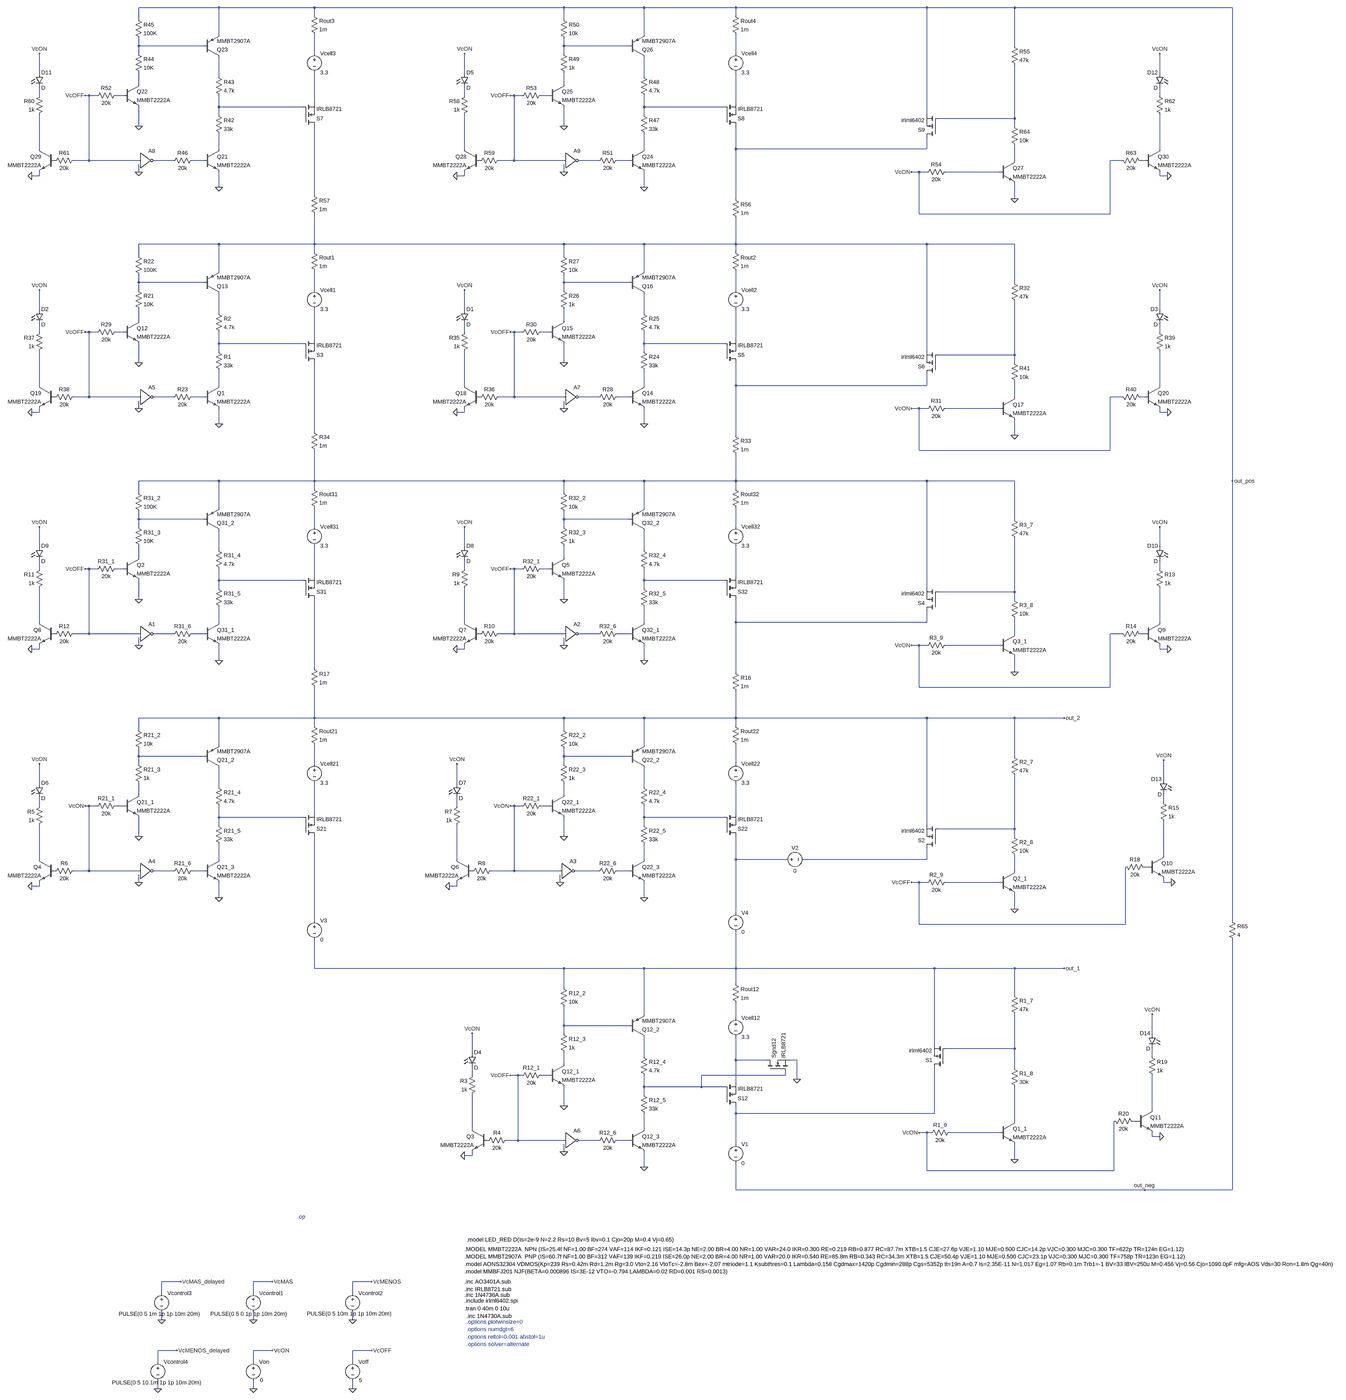
[diagram p0: schematic 5_bancos.asc, whole sheet]
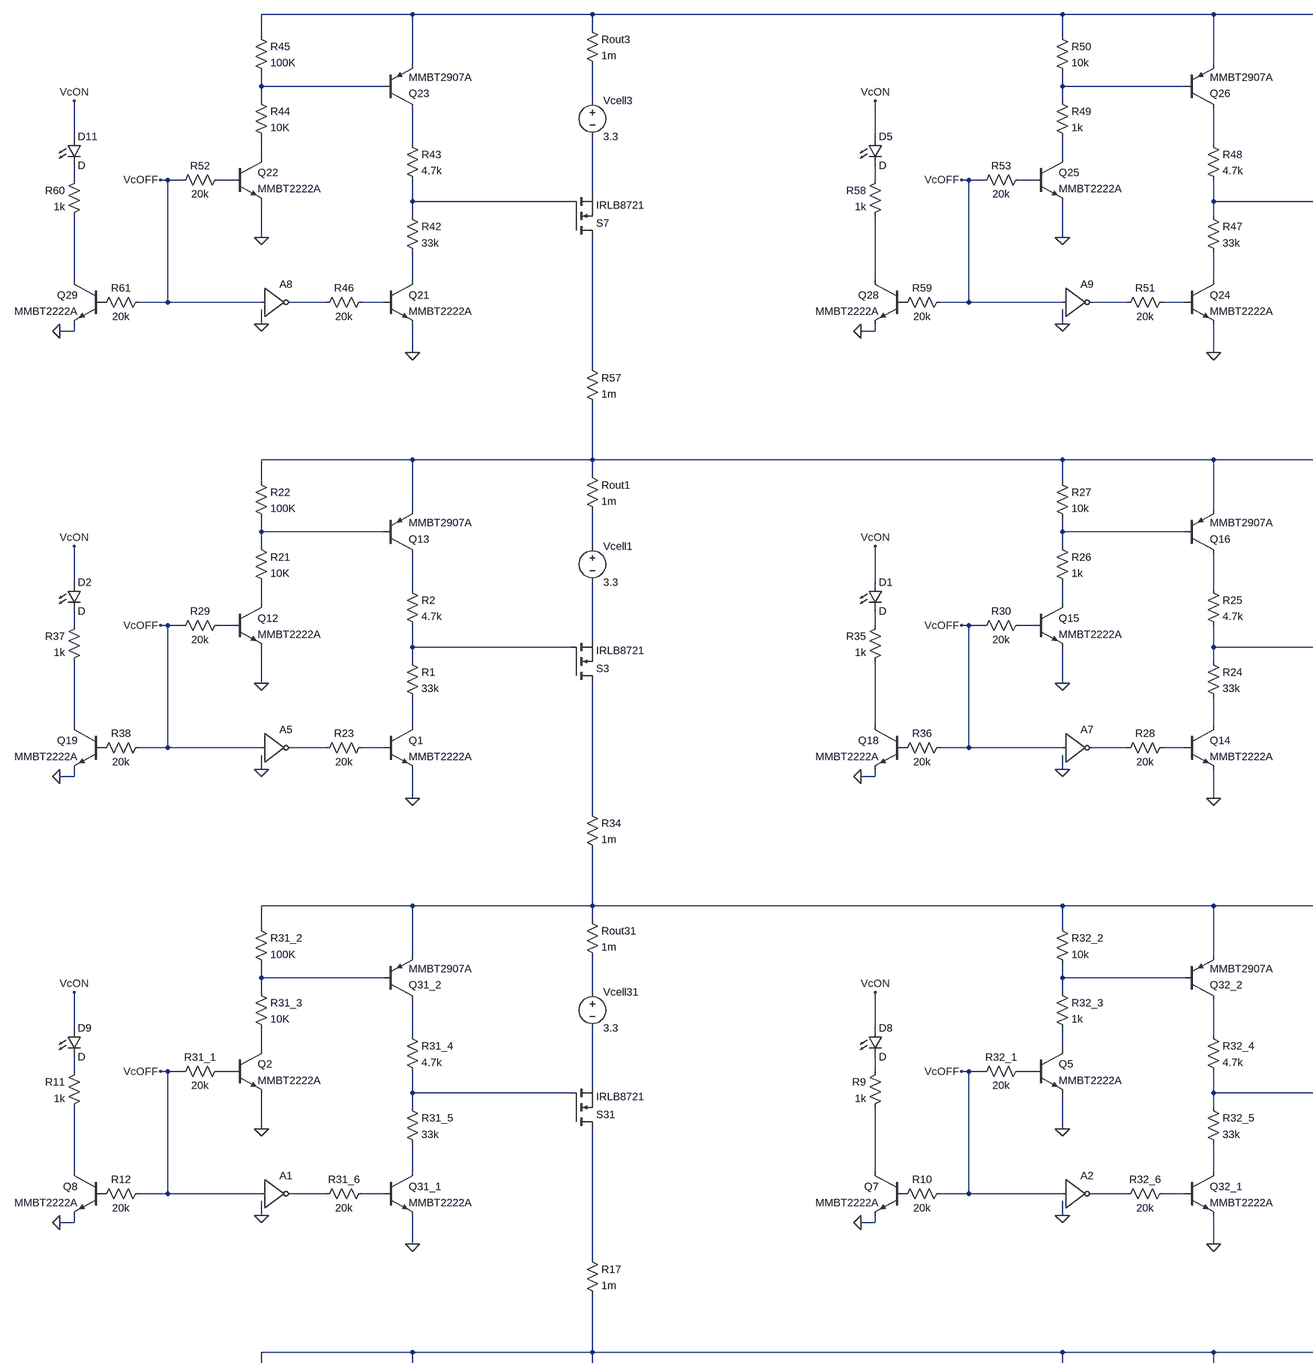
[diagram p1: schematic 5_bancos.asc, part, row 1 of 2, column 1 of 2]
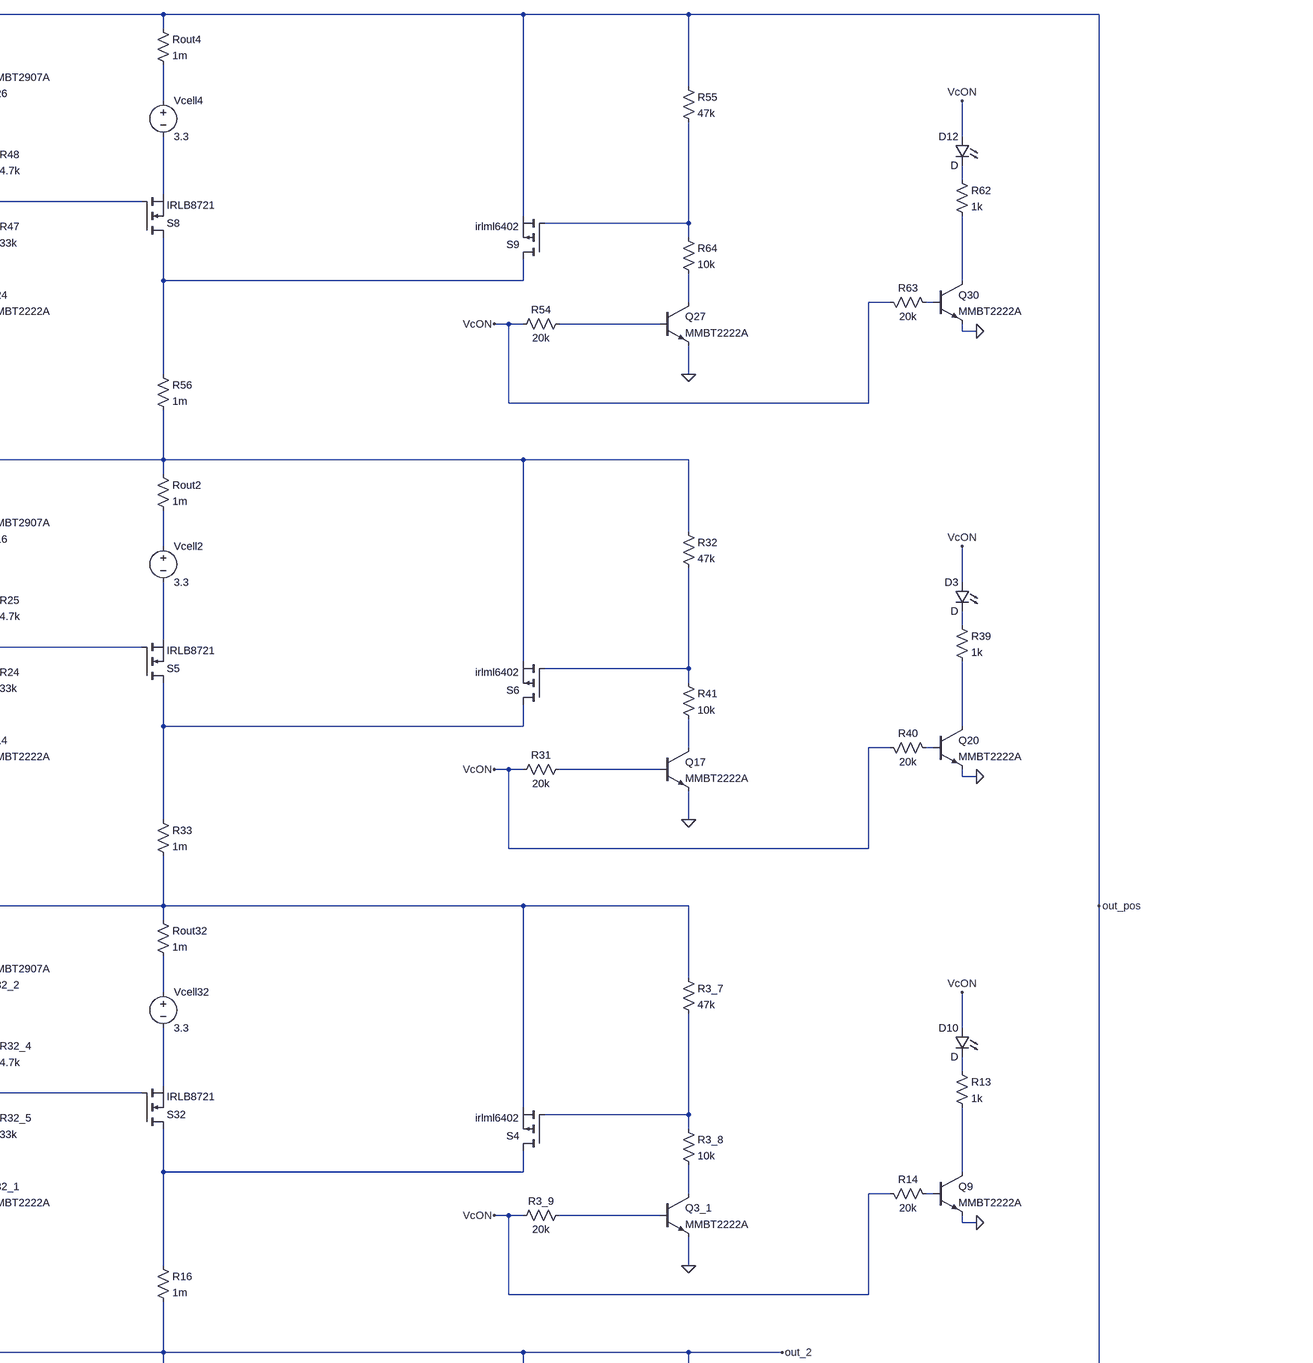
[diagram p2: schematic 5_bancos.asc, part, row 1 of 2, column 2 of 2]
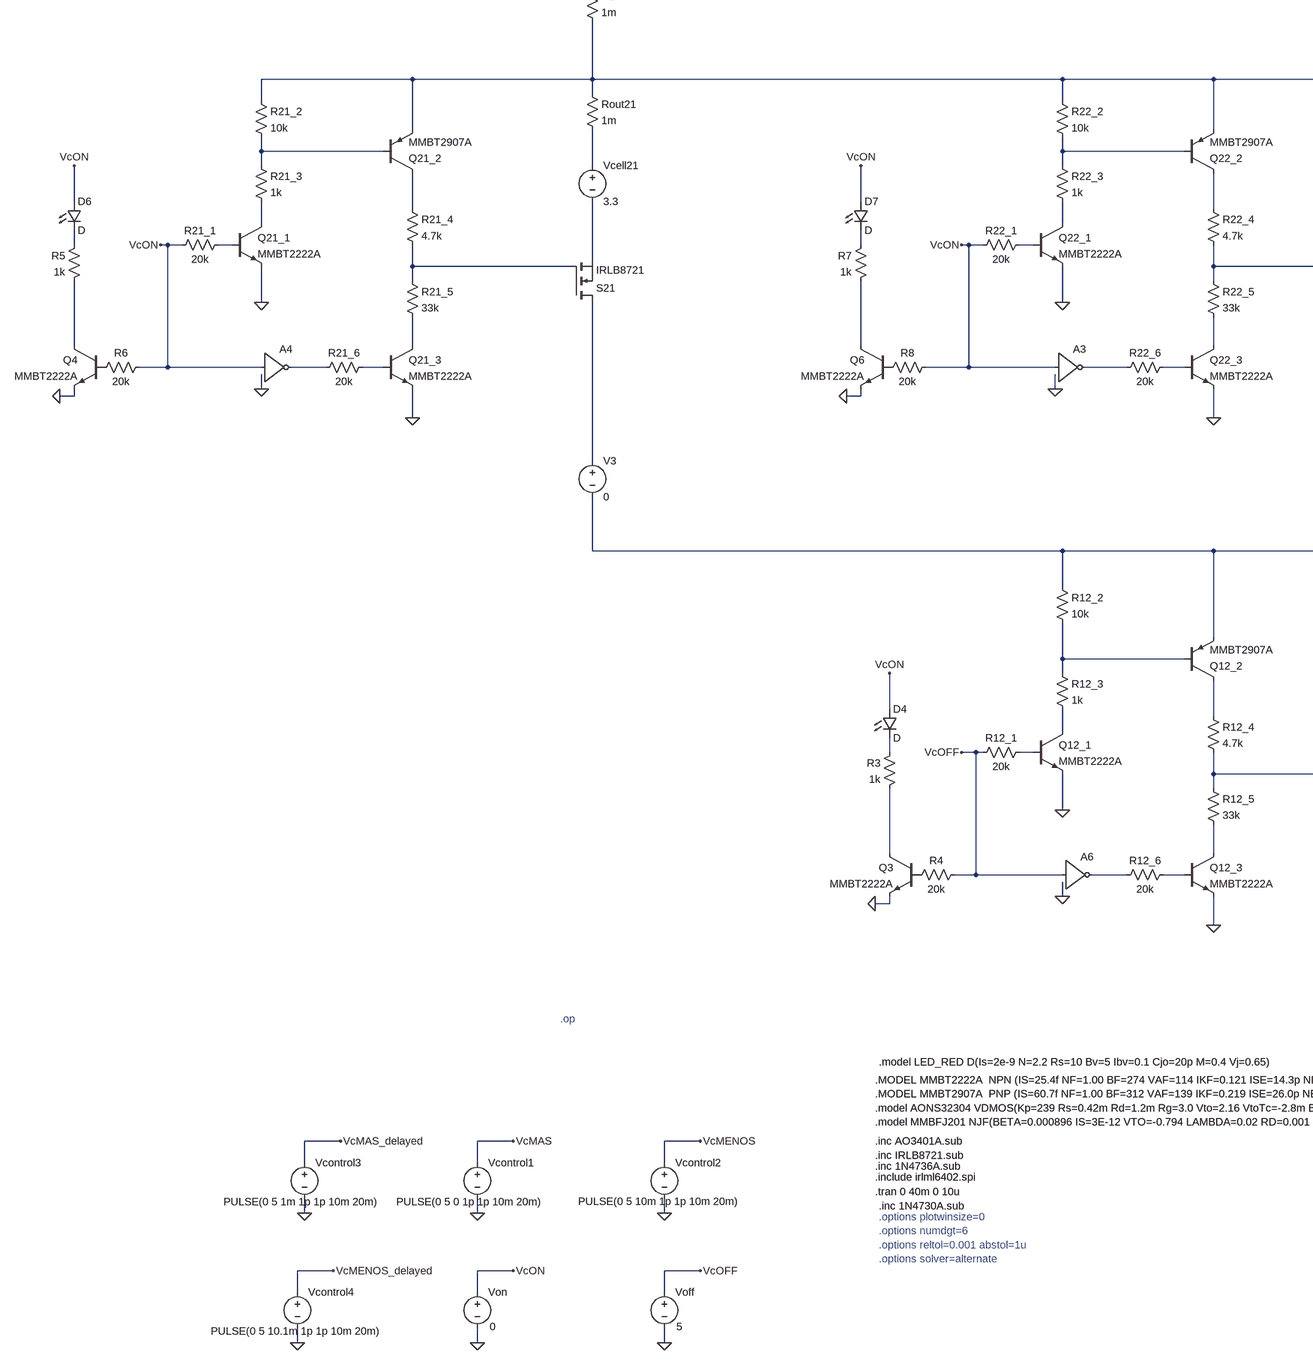
[diagram p3: schematic 5_bancos.asc, part, row 2 of 2, column 1 of 2]
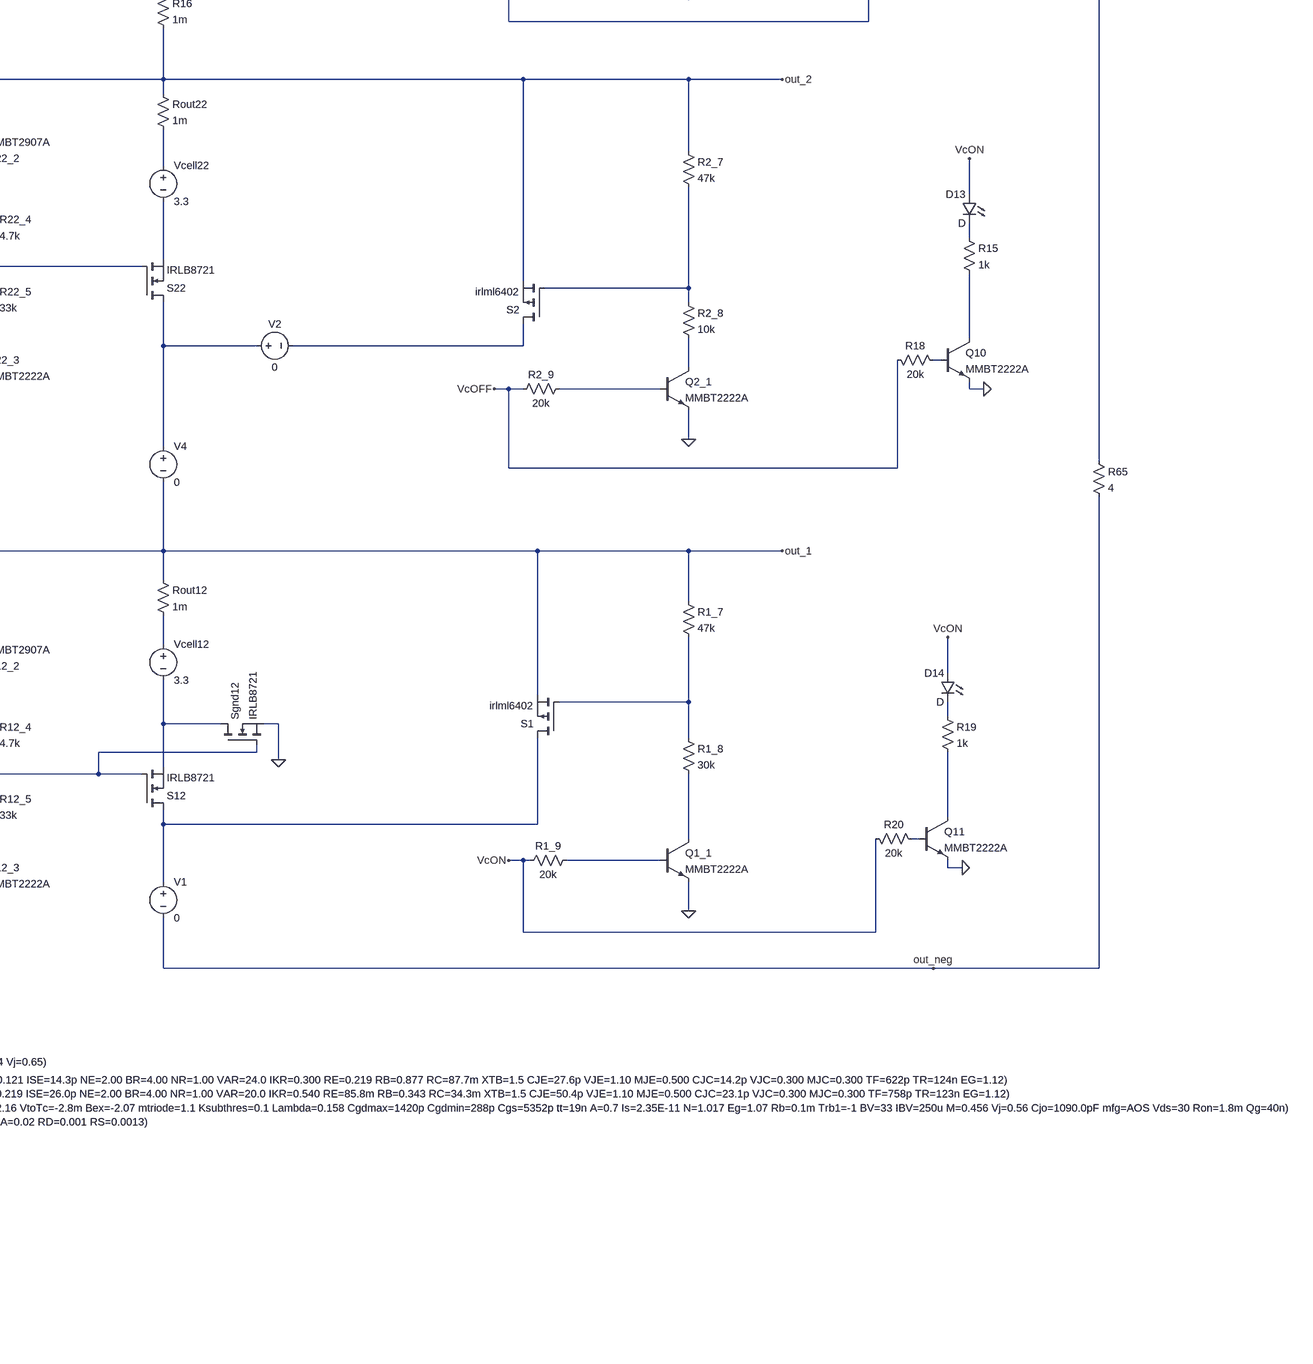
[diagram p4: schematic 5_bancos.asc, part, row 2 of 2, column 2 of 2]
5_bancos.asc, the LTspice schematic file:
Version 4.1
SHEET 1 7672 2128
WIRE -1296 -4512 -1632 -4512
WIRE -896 -4512 -1296 -4512
WIRE 192 -4512 -896 -4512
WIRE 528 -4512 192 -4512
WIRE 912 -4512 528 -4512
WIRE 1712 -4512 912 -4512
WIRE 2080 -4512 1712 -4512
WIRE 2992 -4512 2080 -4512
WIRE -896 -4480 -896 -4512
WIRE 912 -4480 912 -4512
WIRE -1632 -4464 -1632 -4512
WIRE 192 -4464 192 -4512
WIRE -1296 -4400 -1296 -4512
WIRE 528 -4400 528 -4512
WIRE -1632 -4352 -1632 -4384
WIRE -1360 -4352 -1632 -4352
WIRE 192 -4352 192 -4384
WIRE 464 -4352 192 -4352
WIRE 2080 -4352 2080 -4512
WIRE -1632 -4320 -1632 -4352
WIRE -896 -4320 -896 -4400
WIRE 192 -4320 192 -4352
WIRE 912 -4320 912 -4400
WIRE -2048 -4240 -2048 -4320
WIRE -224 -4240 -224 -4320
WIRE 2688 -4240 2688 -4320
WIRE -1296 -4224 -1296 -4304
WIRE 528 -4224 528 -4304
WIRE -1632 -4192 -1632 -4240
WIRE 192 -4192 192 -4240
WIRE -2048 -4144 -2048 -4176
WIRE -1840 -4144 -1856 -4144
WIRE -1808 -4144 -1840 -4144
WIRE -1696 -4144 -1728 -4144
WIRE -224 -4144 -224 -4176
WIRE -16 -4144 -32 -4144
WIRE 16 -4144 -16 -4144
WIRE 128 -4144 96 -4144
WIRE 2688 -4144 2688 -4176
WIRE -896 -4112 -896 -4240
WIRE 912 -4112 912 -4240
WIRE -1296 -4096 -1296 -4144
WIRE -944 -4096 -1296 -4096
WIRE 528 -4096 528 -4144
WIRE 864 -4096 528 -4096
WIRE -1296 -4064 -1296 -4096
WIRE 528 -4064 528 -4096
WIRE 1712 -4064 1712 -4512
WIRE 2080 -4048 2080 -4272
WIRE 2080 -4048 1760 -4048
WIRE -1632 -4016 -1632 -4096
WIRE 192 -4016 192 -4096
WIRE 2080 -4016 2080 -4048
WIRE -2048 -3920 -2048 -4064
WIRE -1296 -3920 -1296 -3984
WIRE -224 -3920 -224 -4064
WIRE 528 -3920 528 -3984
WIRE 912 -3920 912 -4016
WIRE 1712 -3920 1712 -3968
WIRE 1712 -3920 912 -3920
WIRE 2688 -3920 2688 -4064
WIRE -1840 -3872 -1840 -4144
WIRE -1840 -3872 -1904 -3872
WIRE -1632 -3872 -1840 -3872
WIRE -1488 -3872 -1568 -3872
WIRE -1360 -3872 -1408 -3872
WIRE -16 -3872 -16 -4144
WIRE -16 -3872 -80 -3872
WIRE 192 -3872 -16 -3872
WIRE 336 -3872 256 -3872
WIRE 464 -3872 416 -3872
WIRE 2080 -3872 2080 -3936
WIRE 2528 -3872 2480 -3872
WIRE 2624 -3872 2608 -3872
WIRE -1632 -3824 -1632 -3856
WIRE 192 -3824 192 -3856
WIRE 1680 -3824 1648 -3824
WIRE 1712 -3824 1680 -3824
WIRE 2016 -3824 1792 -3824
WIRE -2048 -3808 -2048 -3824
WIRE -2048 -3808 -2080 -3808
WIRE -224 -3808 -224 -3824
WIRE -224 -3808 -256 -3808
WIRE 2688 -3808 2688 -3824
WIRE 2720 -3808 2688 -3808
WIRE -1296 -3760 -1296 -3824
WIRE 528 -3760 528 -3824
WIRE -896 -3728 -896 -4016
WIRE 912 -3712 912 -3920
WIRE 2080 -3712 2080 -3776
WIRE 1680 -3648 1680 -3824
WIRE 2480 -3648 2480 -3872
WIRE 2480 -3648 1680 -3648
WIRE -1296 -3520 -1632 -3520
WIRE -896 -3520 -896 -3648
WIRE -896 -3520 -1296 -3520
WIRE 192 -3520 -896 -3520
WIRE 528 -3520 192 -3520
WIRE 912 -3520 912 -3632
WIRE 912 -3520 528 -3520
WIRE 1712 -3520 912 -3520
WIRE 2080 -3520 1712 -3520
WIRE -896 -3488 -896 -3520
WIRE 912 -3488 912 -3520
WIRE -1632 -3472 -1632 -3520
WIRE 192 -3472 192 -3520
WIRE -1296 -3408 -1296 -3520
WIRE 528 -3408 528 -3520
WIRE -1632 -3360 -1632 -3392
WIRE -1360 -3360 -1632 -3360
WIRE 192 -3360 192 -3392
WIRE 464 -3360 192 -3360
WIRE 2080 -3360 2080 -3520
WIRE -1632 -3328 -1632 -3360
WIRE -896 -3328 -896 -3408
WIRE 192 -3328 192 -3360
WIRE 912 -3328 912 -3408
WIRE -2048 -3248 -2048 -3328
WIRE -224 -3248 -224 -3328
WIRE 2688 -3248 2688 -3328
WIRE -1296 -3232 -1296 -3312
WIRE 528 -3232 528 -3312
WIRE -1632 -3200 -1632 -3248
WIRE 192 -3200 192 -3248
WIRE -2048 -3152 -2048 -3184
WIRE -1840 -3152 -1856 -3152
WIRE -1808 -3152 -1840 -3152
WIRE -1696 -3152 -1728 -3152
WIRE -224 -3152 -224 -3184
WIRE -16 -3152 -32 -3152
WIRE 16 -3152 -16 -3152
WIRE 128 -3152 96 -3152
WIRE 2688 -3152 2688 -3184
WIRE -896 -3120 -896 -3248
WIRE 912 -3120 912 -3248
WIRE -1296 -3104 -1296 -3152
WIRE -944 -3104 -1296 -3104
WIRE 528 -3104 528 -3152
WIRE 864 -3104 528 -3104
WIRE -1296 -3072 -1296 -3104
WIRE 528 -3072 528 -3104
WIRE 1712 -3072 1712 -3520
WIRE 2080 -3056 2080 -3280
WIRE 2080 -3056 1760 -3056
WIRE -1632 -3024 -1632 -3104
WIRE 192 -3024 192 -3104
WIRE 2080 -3024 2080 -3056
WIRE -2048 -2928 -2048 -3072
WIRE -1296 -2928 -1296 -2992
WIRE -224 -2928 -224 -3072
WIRE 528 -2928 528 -2992
WIRE 912 -2928 912 -3024
WIRE 1712 -2928 1712 -2976
WIRE 1712 -2928 912 -2928
WIRE 2688 -2928 2688 -3072
WIRE -1840 -2880 -1840 -3152
WIRE -1840 -2880 -1904 -2880
WIRE -1632 -2880 -1840 -2880
WIRE -1488 -2880 -1568 -2880
WIRE -1360 -2880 -1408 -2880
WIRE -16 -2880 -16 -3152
WIRE -16 -2880 -80 -2880
WIRE 192 -2880 -16 -2880
WIRE 336 -2880 256 -2880
WIRE 464 -2880 416 -2880
WIRE 2080 -2880 2080 -2944
WIRE 2528 -2880 2480 -2880
WIRE 2624 -2880 2608 -2880
WIRE -1632 -2832 -1632 -2864
WIRE 192 -2832 192 -2864
WIRE 1680 -2832 1648 -2832
WIRE 1712 -2832 1680 -2832
WIRE 2016 -2832 1792 -2832
WIRE -2048 -2816 -2048 -2832
WIRE -2048 -2816 -2080 -2816
WIRE -224 -2816 -224 -2832
WIRE -224 -2816 -256 -2816
WIRE 2688 -2816 2688 -2832
WIRE 2720 -2816 2688 -2816
WIRE -1296 -2768 -1296 -2832
WIRE 528 -2768 528 -2832
WIRE -896 -2736 -896 -3024
WIRE 912 -2720 912 -2928
WIRE 2080 -2720 2080 -2784
WIRE 1680 -2656 1680 -2832
WIRE 2480 -2656 2480 -2880
WIRE 2480 -2656 1680 -2656
WIRE -1296 -2512 -1632 -2512
WIRE -896 -2512 -896 -2656
WIRE -896 -2512 -1296 -2512
WIRE 192 -2512 -896 -2512
WIRE 528 -2512 192 -2512
WIRE 912 -2512 912 -2640
WIRE 912 -2512 528 -2512
WIRE 1712 -2512 912 -2512
WIRE 2080 -2512 1712 -2512
WIRE 2992 -2512 2992 -4512
WIRE -896 -2480 -896 -2512
WIRE 912 -2480 912 -2512
WIRE -1632 -2464 -1632 -2512
WIRE 192 -2464 192 -2512
WIRE -1296 -2400 -1296 -2512
WIRE 528 -2400 528 -2512
WIRE -1632 -2352 -1632 -2384
WIRE -1360 -2352 -1632 -2352
WIRE 192 -2352 192 -2384
WIRE 464 -2352 192 -2352
WIRE 2080 -2352 2080 -2512
WIRE -1632 -2320 -1632 -2352
WIRE -896 -2320 -896 -2400
WIRE 192 -2320 192 -2352
WIRE 912 -2320 912 -2400
WIRE -2048 -2240 -2048 -2320
WIRE -224 -2240 -224 -2320
WIRE 2688 -2240 2688 -2320
WIRE -1296 -2224 -1296 -2304
WIRE 528 -2224 528 -2304
WIRE -1632 -2192 -1632 -2240
WIRE 192 -2192 192 -2240
WIRE -2048 -2144 -2048 -2176
WIRE -1840 -2144 -1856 -2144
WIRE -1808 -2144 -1840 -2144
WIRE -1696 -2144 -1728 -2144
WIRE -224 -2144 -224 -2176
WIRE -16 -2144 -32 -2144
WIRE 16 -2144 -16 -2144
WIRE 128 -2144 96 -2144
WIRE 2688 -2144 2688 -2176
WIRE -896 -2112 -896 -2240
WIRE 912 -2112 912 -2240
WIRE -1296 -2096 -1296 -2144
WIRE -944 -2096 -1296 -2096
WIRE 528 -2096 528 -2144
WIRE 864 -2096 528 -2096
WIRE -1296 -2064 -1296 -2096
WIRE 528 -2064 528 -2096
WIRE 1712 -2064 1712 -2512
WIRE 2080 -2048 2080 -2272
WIRE 2080 -2048 1760 -2048
WIRE -1632 -2016 -1632 -2096
WIRE 192 -2016 192 -2096
WIRE 2080 -2016 2080 -2048
WIRE -2048 -1920 -2048 -2064
WIRE -1296 -1920 -1296 -1984
WIRE -224 -1920 -224 -2064
WIRE 528 -1920 528 -1984
WIRE 912 -1920 912 -2016
WIRE 1712 -1920 1712 -1968
WIRE 1712 -1920 912 -1920
WIRE 2688 -1920 2688 -2064
WIRE -1840 -1872 -1840 -2144
WIRE -1840 -1872 -1904 -1872
WIRE -1632 -1872 -1840 -1872
WIRE -1488 -1872 -1568 -1872
WIRE -1360 -1872 -1408 -1872
WIRE -16 -1872 -16 -2144
WIRE -16 -1872 -80 -1872
WIRE 192 -1872 -16 -1872
WIRE 336 -1872 256 -1872
WIRE 464 -1872 416 -1872
WIRE 2080 -1872 2080 -1936
WIRE 2528 -1872 2480 -1872
WIRE 2624 -1872 2608 -1872
WIRE -1632 -1824 -1632 -1856
WIRE 192 -1824 192 -1856
WIRE 1680 -1824 1648 -1824
WIRE 1712 -1824 1680 -1824
WIRE 2016 -1824 1792 -1824
WIRE -2048 -1808 -2048 -1824
WIRE -2048 -1808 -2080 -1808
WIRE -224 -1808 -224 -1824
WIRE -224 -1808 -256 -1808
WIRE 2688 -1808 2688 -1824
WIRE 2720 -1808 2688 -1808
WIRE -1296 -1760 -1296 -1824
WIRE 528 -1760 528 -1824
WIRE -896 -1728 -896 -2016
WIRE 912 -1712 912 -1920
WIRE 2080 -1712 2080 -1776
WIRE 1680 -1648 1680 -1824
WIRE 2480 -1648 2480 -1872
WIRE 2480 -1648 1680 -1648
WIRE -1296 -1456 -1632 -1456
WIRE -896 -1456 -896 -1648
WIRE -896 -1456 -1296 -1456
WIRE 192 -1456 -896 -1456
WIRE 528 -1456 192 -1456
WIRE 912 -1456 912 -1632
WIRE 912 -1456 528 -1456
WIRE 1712 -1456 912 -1456
WIRE 2080 -1456 1712 -1456
WIRE 2288 -1456 2080 -1456
WIRE -896 -1424 -896 -1456
WIRE 912 -1424 912 -1456
WIRE -1632 -1408 -1632 -1456
WIRE 192 -1408 192 -1456
WIRE -1296 -1344 -1296 -1456
WIRE 528 -1344 528 -1456
WIRE -1632 -1296 -1632 -1328
WIRE -1360 -1296 -1632 -1296
WIRE 192 -1296 192 -1328
WIRE 464 -1296 192 -1296
WIRE 2080 -1296 2080 -1456
WIRE -1632 -1264 -1632 -1296
WIRE -896 -1264 -896 -1344
WIRE 192 -1264 192 -1296
WIRE 912 -1264 912 -1344
WIRE 2704 -1200 2704 -1280
WIRE -2048 -1184 -2048 -1264
WIRE -256 -1184 -256 -1264
WIRE -1296 -1168 -1296 -1248
WIRE 528 -1168 528 -1248
WIRE -1632 -1136 -1632 -1184
WIRE 192 -1136 192 -1184
WIRE 2704 -1104 2704 -1136
WIRE -2048 -1088 -2048 -1120
WIRE -1840 -1088 -1856 -1088
WIRE -1808 -1088 -1840 -1088
WIRE -1696 -1088 -1728 -1088
WIRE -256 -1088 -256 -1120
WIRE -16 -1088 -32 -1088
WIRE 16 -1088 -16 -1088
WIRE 128 -1088 96 -1088
WIRE -896 -1056 -896 -1184
WIRE 912 -1056 912 -1184
WIRE -1296 -1040 -1296 -1088
WIRE -944 -1040 -1296 -1040
WIRE 528 -1040 528 -1088
WIRE 864 -1040 528 -1040
WIRE -1296 -1008 -1296 -1040
WIRE 528 -1008 528 -1040
WIRE 1712 -1008 1712 -1456
WIRE 2080 -992 2080 -1216
WIRE 2080 -992 1760 -992
WIRE -1632 -960 -1632 -1040
WIRE 192 -960 192 -1040
WIRE 2080 -960 2080 -992
WIRE 2704 -880 2704 -1024
WIRE -2048 -864 -2048 -1008
WIRE -1296 -864 -1296 -928
WIRE -256 -864 -256 -1008
WIRE 528 -864 528 -928
WIRE 912 -864 912 -960
WIRE 1120 -864 912 -864
WIRE 1712 -864 1712 -912
WIRE 1712 -864 1200 -864
WIRE 2640 -832 2624 -832
WIRE -1840 -816 -1840 -1088
WIRE -1840 -816 -1904 -816
WIRE -1632 -816 -1840 -816
WIRE -1488 -816 -1568 -816
WIRE -1360 -816 -1408 -816
WIRE -16 -816 -16 -1088
WIRE -16 -816 -112 -816
WIRE 176 -816 -16 -816
WIRE 336 -816 240 -816
WIRE 464 -816 416 -816
WIRE 2080 -816 2080 -880
WIRE -1632 -768 -1632 -800
WIRE 176 -768 176 -800
WIRE 1680 -768 1648 -768
WIRE 1712 -768 1680 -768
WIRE 2016 -768 1792 -768
WIRE 2704 -768 2704 -784
WIRE 2736 -768 2704 -768
WIRE -2048 -752 -2048 -768
WIRE -2048 -752 -2080 -752
WIRE -256 -752 -256 -768
WIRE -256 -752 -288 -752
WIRE -1296 -704 -1296 -768
WIRE 528 -704 528 -768
WIRE 2080 -656 2080 -720
WIRE 912 -640 912 -864
WIRE -896 -608 -896 -960
WIRE 2992 -608 2992 -2512
WIRE 1680 -592 1680 -768
WIRE 2544 -592 2544 -832
WIRE 2544 -592 1680 -592
WIRE -896 -368 -896 -528
WIRE 192 -368 -896 -368
WIRE 528 -368 192 -368
WIRE 912 -368 912 -560
WIRE 912 -368 528 -368
WIRE 1744 -368 912 -368
WIRE 2080 -368 1744 -368
WIRE 2288 -368 2080 -368
WIRE 912 -304 912 -368
WIRE 192 -288 192 -368
WIRE 2080 -256 2080 -368
WIRE 528 -176 528 -368
WIRE 912 -160 912 -224
WIRE 192 -128 192 -208
WIRE 464 -128 192 -128
WIRE 192 -96 192 -128
WIRE 2656 -96 2656 -176
WIRE 1744 -48 1744 -368
WIRE 2080 -32 2080 -176
WIRE 2080 -32 1792 -32
WIRE -192 -16 -192 -96
WIRE 528 0 528 -80
WIRE 2656 0 2656 -32
WIRE 912 16 912 -80
WIRE 1040 16 912 16
WIRE 1168 16 1136 16
WIRE 192 32 192 -16
WIRE 2080 48 2080 -32
WIRE -192 80 -192 48
WIRE 0 80 -32 80
WIRE 16 80 0 80
WIRE 128 80 96 80
WIRE 1120 80 1120 64
WIRE 1120 80 768 80
WIRE 1168 96 1168 16
WIRE 912 112 912 16
WIRE 528 128 528 80
WIRE 768 128 768 80
WIRE 768 128 528 128
WIRE 864 128 768 128
WIRE 528 160 528 128
WIRE 192 208 192 128
WIRE 2656 224 2656 80
WIRE 912 240 912 208
WIRE 1744 240 1744 48
WIRE 1744 240 912 240
WIRE 2080 272 2080 128
WIRE 2592 272 2576 272
WIRE -192 304 -192 160
WIRE 528 304 528 240
WIRE 1712 320 1680 320
WIRE 1728 320 1712 320
WIRE 2016 320 1808 320
WIRE 2656 336 2656 320
WIRE 2688 336 2656 336
WIRE 0 352 0 80
WIRE 0 352 -48 352
WIRE 192 352 0 352
WIRE 336 352 256 352
WIRE 464 352 416 352
WIRE 912 368 912 240
WIRE 192 400 192 368
WIRE -192 416 -192 400
WIRE -192 416 -224 416
WIRE 2080 432 2080 368
WIRE 528 464 528 400
WIRE 1712 480 1712 320
WIRE 2496 480 2496 272
WIRE 2496 480 1712 480
WIRE 912 560 912 448
WIRE 2624 560 912 560
WIRE 2992 560 2992 -528
WIRE 2992 560 2624 560
WIRE -1456 1024 -1536 1024
WIRE -1072 1024 -1152 1024
WIRE -656 1024 -736 1024
WIRE -1536 1072 -1536 1024
WIRE -1152 1072 -1152 1024
WIRE -736 1072 -736 1024
WIRE -1536 1184 -1536 1152
WIRE -1152 1184 -1152 1152
WIRE -736 1184 -736 1152
WIRE -1472 1312 -1552 1312
WIRE -1072 1312 -1152 1312
WIRE -656 1312 -736 1312
WIRE -1552 1360 -1552 1312
WIRE -1152 1360 -1152 1312
WIRE -736 1360 -736 1312
WIRE -1552 1472 -1552 1440
WIRE -1152 1472 -1152 1440
WIRE -736 1472 -736 1440
FLAG 192 208 0
FLAG 528 464 0
FLAG -1632 -960 0
FLAG -1296 -704 0
FLAG 192 -960 0
FLAG 528 -704 0
FLAG -1152 1184 0
FLAG -736 1184 0
FLAG -1072 1024 VcMAS
FLAG -656 1024 VcMENOS
FLAG -736 1472 0
FLAG -656 1312 VcOFF
FLAG -1152 1472 0
FLAG -1072 1312 VcON
FLAG -1856 -1088 VcON
FLAG -32 -1088 VcON
FLAG -32 80 VcOFF
FLAG 2624 560 out_neg
FLAG 2288 -368 out_1
FLAG 2080 432 0
FLAG 1680 320 VcON
FLAG 2080 -656 0
FLAG 1648 -768 VcOFF
FLAG 2992 -2512 out_pos
FLAG -1536 1184 0
FLAG -1456 1024 VcMAS_delayed
FLAG -1552 1472 0
FLAG -1472 1312 VcMENOS_delayed
FLAG 1168 96 0
FLAG -1632 -2016 0
FLAG -1296 -1760 0
FLAG 192 -2016 0
FLAG 528 -1760 0
FLAG -1856 -2144 VcOFF
FLAG -32 -2144 VcOFF
FLAG 2080 -1712 0
FLAG 1648 -1824 VcON
FLAG -1632 -1824 0
FLAG 192 -1824 0
FLAG 176 -768 0
FLAG -1632 -768 0
FLAG 192 400 0
FLAG 2288 -1456 out_2
FLAG -224 416 0
FLAG -2080 -752 0
FLAG -288 -752 0
FLAG -256 -1808 0
FLAG -2080 -1808 0
FLAG 2720 -1808 0
FLAG 2736 -768 0
FLAG 2688 336 0
FLAG 2656 -176 VcON
FLAG -192 -96 VcON
FLAG -256 -1264 VcON
FLAG -2048 -1264 VcON
FLAG 2704 -1280 VcON
FLAG 2688 -2320 VcON
FLAG -224 -2320 VcON
FLAG -2048 -2320 VcON
FLAG -1632 -3024 0
FLAG -1296 -2768 0
FLAG 192 -3024 0
FLAG 528 -2768 0
FLAG -1856 -3152 VcOFF
FLAG -32 -3152 VcOFF
FLAG 2080 -2720 0
FLAG 1648 -2832 VcON
FLAG -1632 -2832 0
FLAG 192 -2832 0
FLAG -256 -2816 0
FLAG -2080 -2816 0
FLAG 2720 -2816 0
FLAG 2688 -3328 VcON
FLAG -224 -3328 VcON
FLAG -2048 -3328 VcON
FLAG -1632 -4016 0
FLAG -1296 -3760 0
FLAG 192 -4016 0
FLAG 528 -3760 0
FLAG -1856 -4144 VcOFF
FLAG -32 -4144 VcOFF
FLAG 2080 -3712 0
FLAG 1648 -3824 VcON
FLAG -1632 -3824 0
FLAG 192 -3824 0
FLAG -256 -3808 0
FLAG -2080 -3808 0
FLAG 2720 -3808 0
FLAG 2688 -4320 VcON
FLAG -224 -4320 VcON
FLAG -2048 -4320 VcON
DATAFLAG 944 16 ""
DATAFLAG 800 128 ""
DATAFLAG 368 -128 ""
DATAFLAG 2064 -32 ""
DATAFLAG 1392 240 ""
DATAFLAG 1696 -368 ""
DATAFLAG 2080 192 ""
DATAFLAG 528 -48 ""
DATAFLAG 656 -368 ""
DATAFLAG 384 -1296 ""
DATAFLAG 784 -1040 ""
DATAFLAG 1952 -992 ""
DATAFLAG 1344 -864 ""
DATAFLAG 528 -1216 ""
DATAFLAG 192 -1152 ""
DATAFLAG -1008 -1456 ""
DATAFLAG -1056 -1040 ""
DATAFLAG -896 -1120 ""
DATAFLAG -1456 -1296 ""
DATAFLAG -1632 -1168 ""
DATAFLAG -1296 -896 ""
DATAFLAG 528 -880 ""
DATAFLAG 1136 -1456 ""
DATAFLAG 1168 -2512 ""
DATAFLAG 2992 -672 "$-V(out_neg)"
DATAFLAG -1616 -2352 ""
DATAFLAG -1408 -2512 ""
DATAFLAG -1632 -2224 ""
DATAFLAG 1712 -1040 "$-V(out_1)"
DATAFLAG 528 -2256 ""
DATAFLAG -1296 -2256 ""
DATAFLAG 400 -2352 ""
DATAFLAG 720 -2096 ""
DATAFLAG 912 -2192 ""
DATAFLAG -1056 -2096 ""
DATAFLAG -896 -2176 ""
DATAFLAG 1168 -3520 ""
DATAFLAG -1616 -3360 ""
DATAFLAG -1408 -3520 ""
DATAFLAG -1632 -3232 ""
DATAFLAG 528 -3264 ""
DATAFLAG -1296 -3264 ""
DATAFLAG 400 -3360 ""
DATAFLAG 720 -3104 ""
DATAFLAG 912 -3200 ""
DATAFLAG -1056 -3104 ""
DATAFLAG -896 -3184 ""
DATAFLAG 1168 -4512 ""
DATAFLAG -1616 -4352 ""
DATAFLAG -1408 -4512 ""
DATAFLAG -1632 -4224 ""
DATAFLAG 528 -4256 ""
DATAFLAG -1296 -4256 ""
DATAFLAG 400 -4352 ""
DATAFLAG 720 -4096 ""
DATAFLAG 912 -4192 ""
DATAFLAG -1056 -4096 ""
DATAFLAG -896 -4176 ""
SYMBOL npn 464 304 R0
SYMATTR InstName Q12_3
SYMATTR Value MMBT2222A
SYMBOL res 512 144 R0
SYMATTR InstName R12_5
SYMATTR Value 33k
SYMBOL res 512 -16 R0
SYMATTR InstName R12_4
SYMATTR Value 4.7k
SYMBOL npn 128 32 R0
SYMATTR InstName Q12_1
SYMATTR Value MMBT2222A
SYMBOL res 176 -112 R0
SYMATTR InstName R12_3
SYMATTR Value 1k
SYMBOL res 176 -304 R0
SYMATTR InstName R12_2
SYMATTR Value 10k
SYMBOL res 432 336 R90
WINDOW 0 0 56 VBottom 2
WINDOW 3 32 56 VTop 2
SYMATTR InstName R12_6
SYMATTR Value 20k
SYMBOL voltage 912 -176 R0
WINDOW 123 0 0 Left 0
WINDOW 39 0 0 Left 0
SYMATTR InstName Vcell12
SYMATTR Value 3.3
SYMBOL pnp 464 -80 M180
SYMATTR InstName Q12_2
SYMATTR Value MMBT2907A
SYMBOL nmos 864 208 M180
SYMATTR InstName S12
SYMATTR Value IRLB8721
SYMATTR Prefix X
SYMBOL npn -1360 -864 R0
SYMATTR InstName Q21_3
SYMATTR Value MMBT2222A
SYMBOL res -1312 -1024 R0
SYMATTR InstName R21_5
SYMATTR Value 33k
SYMBOL res -1312 -1184 R0
SYMATTR InstName R21_4
SYMATTR Value 4.7k
SYMBOL npn -1696 -1136 R0
SYMATTR InstName Q21_1
SYMATTR Value MMBT2222A
SYMBOL res -1648 -1280 R0
SYMATTR InstName R21_3
SYMATTR Value 1k
SYMBOL res -1648 -1424 R0
SYMATTR InstName R21_2
SYMATTR Value 10k
SYMBOL res -1392 -832 R90
WINDOW 0 0 56 VBottom 2
WINDOW 3 32 56 VTop 2
SYMATTR InstName R21_6
SYMATTR Value 20k
SYMBOL voltage -896 -1280 R0
WINDOW 123 0 0 Left 0
WINDOW 39 0 0 Left 0
SYMATTR InstName Vcell21
SYMATTR Value 3.3
SYMBOL pnp -1360 -1248 M180
SYMATTR InstName Q21_2
SYMATTR Value MMBT2907A
SYMBOL nmos -944 -960 M180
SYMATTR InstName S21
SYMATTR Value IRLB8721
SYMATTR Prefix X
SYMBOL npn 464 -864 R0
SYMATTR InstName Q22_3
SYMATTR Value MMBT2222A
SYMBOL res 512 -1024 R0
SYMATTR InstName R22_5
SYMATTR Value 33k
SYMBOL res 512 -1184 R0
SYMATTR InstName R22_4
SYMATTR Value 4.7k
SYMBOL npn 128 -1136 R0
SYMATTR InstName Q22_1
SYMATTR Value MMBT2222A
SYMBOL res 176 -1280 R0
SYMATTR InstName R22_3
SYMATTR Value 1k
SYMBOL res 176 -1424 R0
SYMATTR InstName R22_2
SYMATTR Value 10k
SYMBOL res 432 -832 R90
WINDOW 0 0 56 VBottom 2
WINDOW 3 32 56 VTop 2
SYMATTR InstName R22_6
SYMATTR Value 20k
SYMBOL voltage 912 -1280 R0
WINDOW 123 0 0 Left 0
WINDOW 39 0 0 Left 0
SYMATTR InstName Vcell22
SYMATTR Value 3.3
SYMBOL pnp 464 -1248 M180
SYMATTR InstName Q22_2
SYMATTR Value MMBT2907A
SYMBOL nmos 864 -960 M180
SYMATTR InstName S22
SYMATTR Value IRLB8721
SYMATTR Prefix X
SYMBOL voltage -1152 1056 R0
WINDOW 3 -180 103 Left 2
WINDOW 123 0 0 Left 0
WINDOW 39 0 0 Left 0
SYMATTR Value PULSE(0 5 0 1p 1p 10m 20m)
SYMATTR InstName Vcontrol1
SYMBOL voltage -736 1056 R0
WINDOW 3 -192 102 Left 2
WINDOW 123 0 0 Left 0
WINDOW 39 0 0 Left 0
SYMATTR Value PULSE(0 5 10m 1p 1p 10m 20m)
SYMATTR InstName Vcontrol2
SYMBOL voltage -736 1344 R0
WINDOW 3 27 92 Left 2
WINDOW 123 0 0 Left 0
WINDOW 39 0 0 Left 0
SYMATTR Value 5
SYMATTR InstName Voff
SYMBOL voltage -1152 1344 R0
WINDOW 3 28 92 Left 2
WINDOW 123 0 0 Left 0
WINDOW 39 0 0 Left 0
SYMATTR Value 0
SYMATTR InstName Von
SYMBOL res -1712 -1104 R90
WINDOW 0 0 56 VBottom 2
WINDOW 3 32 56 VTop 2
SYMATTR InstName R21_1
SYMATTR Value 20k
SYMBOL res 112 -1104 R90
WINDOW 0 0 56 VBottom 2
WINDOW 3 32 56 VTop 2
SYMATTR InstName R22_1
SYMATTR Value 20k
SYMBOL res 112 64 R90
WINDOW 0 0 56 VBottom 2
WINDOW 3 32 56 VTop 2
SYMATTR InstName R12_1
SYMATTR Value 20k
SYMBOL res 896 -320 R0
SYMATTR InstName Rout12
SYMATTR Value 1m
SYMBOL res -912 -1440 R0
SYMATTR InstName Rout21
SYMATTR Value 1m
SYMBOL res 896 -1440 R0
SYMATTR InstName Rout22
SYMATTR Value 1m
SYMBOL npn 2016 272 R0
SYMATTR InstName Q1_1
SYMATTR Value MMBT2222A
SYMBOL res 1824 304 R90
WINDOW 0 0 56 VBottom 2
WINDOW 3 32 56 VTop 2
SYMATTR InstName R1_9
SYMATTR Value 20k
SYMBOL res 2064 -272 R0
SYMATTR InstName R1_7
SYMATTR Value 47k
SYMBOL npn 2016 -816 R0
SYMATTR InstName Q2_1
SYMATTR Value MMBT2222A
SYMBOL res 1808 -784 R90
WINDOW 0 0 56 VBottom 2
WINDOW 3 32 56 VTop 2
SYMATTR InstName R2_9
SYMATTR Value 20k
SYMBOL res 2064 -1312 R0
SYMATTR InstName R2_7
SYMATTR Value 47k
SYMBOL voltage -1536 1056 R0
WINDOW 3 -180 103 Left 2
WINDOW 123 0 0 Left 0
WINDOW 39 0 0 Left 0
SYMATTR Value PULSE(0 5 1m 1p 1p 10m 20m)
SYMATTR InstName Vcontrol3
SYMBOL voltage -1552 1344 R0
WINDOW 3 -192 102 Left 2
WINDOW 123 0 0 Left 0
WINDOW 39 0 0 Left 0
SYMATTR Value PULSE(0 5 10.1m 1p 1p 10m 20m)
SYMATTR InstName Vcontrol4
SYMBOL nmos 1040 64 R270
SYMATTR InstName Sgnd12
SYMATTR Value IRLB8721
SYMATTR Prefix X
SYMBOL npn -1360 -1920 R0
SYMATTR InstName Q31_1
SYMATTR Value MMBT2222A
SYMBOL res -1312 -2080 R0
SYMATTR InstName R31_5
SYMATTR Value 33k
SYMBOL res -1312 -2240 R0
SYMATTR InstName R31_4
SYMATTR Value 4.7k
SYMBOL npn -1696 -2192 R0
SYMATTR InstName Q2
SYMATTR Value MMBT2222A
SYMBOL res -1648 -2336 R0
SYMATTR InstName R31_3
SYMATTR Value 10K
SYMBOL res -1648 -2480 R0
SYMATTR InstName R31_2
SYMATTR Value 100K
SYMBOL res -1392 -1888 R90
WINDOW 0 0 56 VBottom 2
WINDOW 3 32 56 VTop 2
SYMATTR InstName R31_6
SYMATTR Value 20k
SYMBOL voltage -896 -2336 R0
WINDOW 123 0 0 Left 0
WINDOW 39 0 0 Left 0
SYMATTR InstName Vcell31
SYMATTR Value 3.3
SYMBOL pnp -1360 -2304 M180
SYMATTR InstName Q31_2
SYMATTR Value MMBT2907A
SYMBOL nmos -944 -2016 M180
SYMATTR InstName S31
SYMATTR Value IRLB8721
SYMATTR Prefix X
SYMBOL npn 464 -1920 R0
SYMATTR InstName Q32_1
SYMATTR Value MMBT2222A
SYMBOL res 512 -2080 R0
SYMATTR InstName R32_5
SYMATTR Value 33k
SYMBOL res 512 -2240 R0
SYMATTR InstName R32_4
SYMATTR Value 4.7k
SYMBOL npn 128 -2192 R0
SYMATTR InstName Q5
SYMATTR Value MMBT2222A
SYMBOL res 176 -2336 R0
SYMATTR InstName R32_3
SYMATTR Value 1k
SYMBOL res 176 -2480 R0
SYMATTR InstName R32_2
SYMATTR Value 10k
SYMBOL res 432 -1888 R90
WINDOW 0 0 56 VBottom 2
WINDOW 3 32 56 VTop 2
SYMATTR InstName R32_6
SYMATTR Value 20k
SYMBOL voltage 912 -2336 R0
WINDOW 123 0 0 Left 0
WINDOW 39 0 0 Left 0
SYMATTR InstName Vcell32
SYMATTR Value 3.3
SYMBOL pnp 464 -2304 M180
SYMATTR InstName Q32_2
SYMATTR Value MMBT2907A
SYMBOL nmos 864 -2016 M180
SYMATTR InstName S32
SYMATTR Value IRLB8721
SYMATTR Prefix X
SYMBOL res -1712 -2160 R90
WINDOW 0 0 56 VBottom 2
WINDOW 3 32 56 VTop 2
SYMATTR InstName R31_1
SYMATTR Value 20k
SYMBOL res 112 -2160 R90
WINDOW 0 0 56 VBottom 2
WINDOW 3 32 56 VTop 2
SYMATTR InstName R32_1
SYMATTR Value 20k
SYMBOL res -912 -2496 R0
SYMATTR InstName Rout31
SYMATTR Value 1m
SYMBOL res 896 -2496 R0
SYMATTR InstName Rout32
SYMATTR Value 1m
SYMBOL npn 2016 -1872 R0
SYMATTR InstName Q3_1
SYMATTR Value MMBT2222A
SYMBOL res 1808 -1840 R90
WINDOW 0 0 56 VBottom 2
WINDOW 3 32 56 VTop 2
SYMATTR InstName R3_9
SYMATTR Value 20k
SYMBOL res 2064 -2368 R0
SYMATTR InstName R3_7
SYMATTR Value 47k
SYMBOL res 896 -1728 R0
SYMATTR InstName R16
SYMATTR Value 1m
SYMBOL res -912 -1744 R0
SYMATTR InstName R17
SYMATTR Value 1m
SYMBOL Digital\\inv -1632 -1936 R0
SYMATTR InstName A1
SYMBOL Digital\\inv 192 -1936 R0
SYMATTR InstName A2
SYMBOL Digital\\inv 176 -880 R0
SYMATTR InstName A3
SYMBOL Digital\\inv -1632 -880 R0
SYMATTR InstName A4
SYMBOL Digital\\inv 192 288 R0
SYMATTR InstName A6
SYMBOL pmos 1760 -1968 R180
SYMATTR InstName S4
SYMATTR Value irlml6402
SYMATTR Prefix X
SYMBOL pmos 1760 -912 R180
SYMATTR InstName S2
SYMATTR Value irlml6402
SYMATTR Prefix X
SYMBOL pmos 1792 48 R180
SYMATTR InstName S1
SYMATTR Value irlml6402
SYMATTR Prefix X
SYMBOL voltage 912 352 R0
WINDOW 123 0 0 Left 0
WINDOW 39 0 0 Left 0
SYMATTR InstName V1
SYMATTR Value 0
SYMBOL npn -128 304 M0
SYMATTR InstName Q3
SYMATTR Value MMBT2222A
SYMBOL res -176 64 M0
SYMATTR InstName R3
SYMATTR Value 1k
SYMBOL res -32 336 R90
WINDOW 0 0 56 VBottom 2
WINDOW 3 32 56 VTop 2
SYMATTR InstName R4
SYMATTR Value 20k
SYMBOL LED -208 -16 R0
SYMATTR InstName D4
SYMBOL npn -1984 -864 M0
SYMATTR InstName Q4
SYMATTR Value MMBT2222A
SYMBOL res -2032 -1104 M0
SYMATTR InstName R5
SYMATTR Value 1k
SYMBOL res -1888 -832 R90
WINDOW 0 0 56 VBottom 2
WINDOW 3 32 56 VTop 2
SYMATTR InstName R6
SYMATTR Value 20k
SYMBOL LED -2064 -1184 R0
SYMATTR InstName D6
SYMBOL npn -192 -864 M0
SYMATTR InstName Q6
SYMATTR Value MMBT2222A
SYMBOL res -240 -1104 M0
SYMATTR InstName R7
SYMATTR Value 1k
SYMBOL res -96 -832 R90
WINDOW 0 0 56 VBottom 2
WINDOW 3 32 56 VTop 2
SYMATTR InstName R8
SYMATTR Value 20k
SYMBOL LED -272 -1184 R0
SYMATTR InstName D7
SYMBOL npn -160 -1920 M0
SYMATTR InstName Q7
SYMATTR Value MMBT2222A
SYMBOL res -208 -2160 M0
SYMATTR InstName R9
SYMATTR Value 1k
SYMBOL res -64 -1888 R90
WINDOW 0 0 56 VBottom 2
WINDOW 3 32 56 VTop 2
SYMATTR InstName R10
SYMATTR Value 20k
SYMBOL LED -240 -2240 R0
SYMATTR InstName D8
SYMBOL npn -1984 -1920 M0
SYMATTR InstName Q8
SYMATTR Value MMBT2222A
SYMBOL res -2032 -2160 M0
SYMATTR InstName R11
SYMATTR Value 1k
SYMBOL res -1888 -1888 R90
WINDOW 0 0 56 VBottom 2
WINDOW 3 32 56 VTop 2
SYMATTR InstName R12
SYMATTR Value 20k
SYMBOL LED -2064 -2240 R0
SYMATTR InstName D9
SYMBOL npn 2624 -1920 R0
SYMATTR InstName Q9
SYMATTR Value MMBT2222A
SYMBOL res 2672 -2160 R0
SYMATTR InstName R13
SYMATTR Value 1k
SYMBOL res 2512 -1888 M90
WINDOW 0 0 56 VBottom 2
WINDOW 3 32 56 VTop 2
SYMATTR InstName R14
SYMATTR Value 20k
SYMBOL LED 2704 -2240 M0
SYMATTR InstName D10
SYMBOL npn 2640 -880 R0
SYMATTR InstName Q10
SYMATTR Value MMBT2222A
SYMBOL res 2688 -1120 R0
SYMATTR InstName R15
SYMATTR Value 1k
SYMBOL res 2528 -848 M90
WINDOW 0 0 56 VBottom 2
WINDOW 3 32 56 VTop 2
SYMATTR InstName R18
SYMATTR Value 20k
SYMBOL LED 2720 -1200 M0
SYMATTR InstName D13
SYMBOL npn 2592 224 R0
SYMATTR InstName Q11
SYMATTR Value MMBT2222A
SYMBOL res 2640 -16 R0
SYMATTR InstName R19
SYMATTR Value 1k
SYMBOL res 2480 256 M90
WINDOW 0 0 56 VBottom 2
WINDOW 3 32 56 VTop 2
SYMATTR InstName R20
SYMATTR Value 20k
SYMBOL LED 2672 -96 M0
SYMATTR InstName D14
SYMBOL res 2064 32 R0
SYMATTR InstName R1_8
SYMATTR Value 30k
SYMBOL res 2064 -976 R0
SYMATTR InstName R2_8
SYMATTR Value 10k
SYMBOL res 2064 -2032 R0
SYMATTR InstName R3_8
SYMATTR Value 10k
SYMBOL npn -1360 -2928 R0
SYMATTR InstName Q1
SYMATTR Value MMBT2222A
SYMBOL res -1312 -3088 R0
SYMATTR InstName R1
SYMATTR Value 33k
SYMBOL res -1312 -3248 R0
SYMATTR InstName R2
SYMATTR Value 4.7k
SYMBOL npn -1696 -3200 R0
SYMATTR InstName Q12
SYMATTR Value MMBT2222A
SYMBOL res -1648 -3344 R0
SYMATTR InstName R21
SYMATTR Value 10K
SYMBOL res -1648 -3488 R0
SYMATTR InstName R22
SYMATTR Value 100K
SYMBOL res -1392 -2896 R90
WINDOW 0 0 56 VBottom 2
WINDOW 3 32 56 VTop 2
SYMATTR InstName R23
SYMATTR Value 20k
SYMBOL voltage -896 -3344 R0
WINDOW 123 0 0 Left 0
WINDOW 39 0 0 Left 0
SYMATTR InstName Vcell1
SYMATTR Value 3.3
SYMBOL pnp -1360 -3312 M180
SYMATTR InstName Q13
SYMATTR Value MMBT2907A
SYMBOL nmos -944 -3024 M180
SYMATTR InstName S3
SYMATTR Value IRLB8721
SYMATTR Prefix X
SYMBOL npn 464 -2928 R0
SYMATTR InstName Q14
SYMATTR Value MMBT2222A
SYMBOL res 512 -3088 R0
SYMATTR InstName R24
SYMATTR Value 33k
SYMBOL res 512 -3248 R0
SYMATTR InstName R25
SYMATTR Value 4.7k
SYMBOL npn 128 -3200 R0
SYMATTR InstName Q15
SYMATTR Value MMBT2222A
SYMBOL res 176 -3344 R0
SYMATTR InstName R26
SYMATTR Value 1k
SYMBOL res 176 -3488 R0
SYMATTR InstName R27
SYMATTR Value 10k
SYMBOL res 432 -2896 R90
WINDOW 0 0 56 VBottom 2
WINDOW 3 32 56 VTop 2
SYMATTR InstName R28
SYMATTR Value 20k
SYMBOL voltage 912 -3344 R0
WINDOW 123 0 0 Left 0
WINDOW 39 0 0 Left 0
SYMATTR InstName Vcell2
SYMATTR Value 3.3
SYMBOL pnp 464 -3312 M180
SYMATTR InstName Q16
SYMATTR Value MMBT2907A
SYMBOL nmos 864 -3024 M180
SYMATTR InstName S5
SYMATTR Value IRLB8721
SYMATTR Prefix X
SYMBOL res -1712 -3168 R90
WINDOW 0 0 56 VBottom 2
WINDOW 3 32 56 VTop 2
SYMATTR InstName R29
SYMATTR Value 20k
SYMBOL res 112 -3168 R90
WINDOW 0 0 56 VBottom 2
WINDOW 3 32 56 VTop 2
SYMATTR InstName R30
SYMATTR Value 20k
SYMBOL res -912 -3504 R0
SYMATTR InstName Rout1
SYMATTR Value 1m
SYMBOL res 896 -3504 R0
SYMATTR InstName Rout2
SYMATTR Value 1m
SYMBOL npn 2016 -2880 R0
SYMATTR InstName Q17
SYMATTR Value MMBT2222A
SYMBOL res 1808 -2848 R90
WINDOW 0 0 56 VBottom 2
WINDOW 3 32 56 VTop 2
SYMATTR InstName R31
SYMATTR Value 20k
SYMBOL res 2064 -3376 R0
SYMATTR InstName R32
SYMATTR Value 47k
SYMBOL res 896 -2736 R0
SYMATTR InstName R33
SYMATTR Value 1m
SYMBOL res -912 -2752 R0
SYMATTR InstName R34
SYMATTR Value 1m
SYMBOL Digital\\inv -1632 -2944 R0
SYMATTR InstName A5
SYMBOL Digital\\inv 192 -2944 R0
SYMATTR InstName A7
SYMBOL pmos 1760 -2976 R180
SYMATTR InstName S6
SYMATTR Value irlml6402
SYMATTR Prefix X
SYMBOL npn -160 -2928 M0
SYMATTR InstName Q18
SYMATTR Value MMBT2222A
SYMBOL res -208 -3168 M0
SYMATTR InstName R35
SYMATTR Value 1k
SYMBOL res -64 -2896 R90
WINDOW 0 0 56 VBottom 2
WINDOW 3 32 56 VTop 2
SYMATTR InstName R36
SYMATTR Value 20k
SYMBOL LED -240 -3248 R0
SYMATTR InstName D1
SYMBOL npn -1984 -2928 M0
SYMATTR InstName Q19
SYMATTR Value MMBT2222A
SYMBOL res -2032 -3168 M0
SYMATTR InstName R37
SYMATTR Value 1k
SYMBOL res -1888 -2896 R90
WINDOW 0 0 56 VBottom 2
WINDOW 3 32 56 VTop 2
SYMATTR InstName R38
SYMATTR Value 20k
SYMBOL LED -2064 -3248 R0
SYMATTR InstName D2
SYMBOL npn 2624 -2928 R0
SYMATTR InstName Q20
SYMATTR Value MMBT2222A
SYMBOL res 2672 -3168 R0
SYMATTR InstName R39
SYMATTR Value 1k
SYMBOL res 2512 -2896 M90
WINDOW 0 0 56 VBottom 2
WINDOW 3 32 56 VTop 2
SYMATTR InstName R40
SYMATTR Value 20k
SYMBOL LED 2704 -3248 M0
SYMATTR InstName D3
SYMBOL res 2064 -3040 R0
SYMATTR InstName R41
SYMATTR Value 10k
SYMBOL npn -1360 -3920 R0
SYMATTR InstName Q21
SYMATTR Value MMBT2222A
SYMBOL res -1312 -4080 R0
SYMATTR InstName R42
SYMATTR Value 33k
SYMBOL res -1312 -4240 R0
SYMATTR InstName R43
SYMATTR Value 4.7k
SYMBOL npn -1696 -4192 R0
SYMATTR InstName Q22
SYMATTR Value MMBT2222A
SYMBOL res -1648 -4336 R0
SYMATTR InstName R44
SYMATTR Value 10K
SYMBOL res -1648 -4480 R0
SYMATTR InstName R45
SYMATTR Value 100K
SYMBOL res -1392 -3888 R90
WINDOW 0 0 56 VBottom 2
WINDOW 3 32 56 VTop 2
SYMATTR InstName R46
SYMATTR Value 20k
SYMBOL voltage -896 -4336 R0
WINDOW 123 0 0 Left 0
WINDOW 39 0 0 Left 0
SYMATTR InstName Vcell3
SYMATTR Value 3.3
SYMBOL pnp -1360 -4304 M180
SYMATTR InstName Q23
SYMATTR Value MMBT2907A
SYMBOL nmos -944 -4016 M180
SYMATTR InstName S7
SYMATTR Value IRLB8721
SYMATTR Prefix X
SYMBOL npn 464 -3920 R0
SYMATTR InstName Q24
SYMATTR Value MMBT2222A
SYMBOL res 512 -4080 R0
SYMATTR InstName R47
SYMATTR Value 33k
SYMBOL res 512 -4240 R0
SYMATTR InstName R48
SYMATTR Value 4.7k
SYMBOL npn 128 -4192 R0
SYMATTR InstName Q25
SYMATTR Value MMBT2222A
SYMBOL res 176 -4336 R0
SYMATTR InstName R49
SYMATTR Value 1k
SYMBOL res 176 -4480 R0
SYMATTR InstName R50
SYMATTR Value 10k
SYMBOL res 432 -3888 R90
WINDOW 0 0 56 VBottom 2
WINDOW 3 32 56 VTop 2
SYMATTR InstName R51
SYMATTR Value 20k
SYMBOL voltage 912 -4336 R0
WINDOW 123 0 0 Left 0
WINDOW 39 0 0 Left 0
SYMATTR InstName Vcell4
SYMATTR Value 3.3
SYMBOL pnp 464 -4304 M180
SYMATTR InstName Q26
SYMATTR Value MMBT2907A
SYMBOL nmos 864 -4016 M180
SYMATTR InstName S8
SYMATTR Value IRLB8721
SYMATTR Prefix X
SYMBOL res -1712 -4160 R90
WINDOW 0 0 56 VBottom 2
WINDOW 3 32 56 VTop 2
SYMATTR InstName R52
SYMATTR Value 20k
SYMBOL res 112 -4160 R90
WINDOW 0 0 56 VBottom 2
WINDOW 3 32 56 VTop 2
SYMATTR InstName R53
SYMATTR Value 20k
SYMBOL res -912 -4496 R0
SYMATTR InstName Rout3
SYMATTR Value 1m
SYMBOL res 896 -4496 R0
SYMATTR InstName Rout4
SYMATTR Value 1m
SYMBOL npn 2016 -3872 R0
SYMATTR InstName Q27
SYMATTR Value MMBT2222A
SYMBOL res 1808 -3840 R90
WINDOW 0 0 56 VBottom 2
WINDOW 3 32 56 VTop 2
SYMATTR InstName R54
SYMATTR Value 20k
SYMBOL res 2064 -4368 R0
SYMATTR InstName R55
SYMATTR Value 47k
SYMBOL res 896 -3728 R0
SYMATTR InstName R56
SYMATTR Value 1m
SYMBOL res -912 -3744 R0
SYMATTR InstName R57
SYMATTR Value 1m
SYMBOL Digital\\inv -1632 -3936 R0
SYMATTR InstName A8
SYMBOL Digital\\inv 192 -3936 R0
SYMATTR InstName A9
SYMBOL pmos 1760 -3968 R180
SYMATTR InstName S9
SYMATTR Value irlml6402
SYMATTR Prefix X
SYMBOL npn -160 -3920 M0
SYMATTR InstName Q28
SYMATTR Value MMBT2222A
SYMBOL res -208 -4160 M0
SYMATTR InstName R58
SYMATTR Value 1k
SYMBOL res -64 -3888 R90
WINDOW 0 0 56 VBottom 2
WINDOW 3 32 56 VTop 2
SYMATTR InstName R59
SYMATTR Value 20k
SYMBOL LED -240 -4240 R0
SYMATTR InstName D5
SYMBOL npn -1984 -3920 M0
SYMATTR InstName Q29
SYMATTR Value MMBT2222A
SYMBOL res -2032 -4160 M0
SYMATTR InstName R60
SYMATTR Value 1k
SYMBOL res -1888 -3888 R90
WINDOW 0 0 56 VBottom 2
WINDOW 3 32 56 VTop 2
SYMATTR InstName R61
SYMATTR Value 20k
SYMBOL LED -2064 -4240 R0
SYMATTR InstName D11
SYMBOL npn 2624 -3920 R0
SYMATTR InstName Q30
SYMATTR Value MMBT2222A
SYMBOL res 2672 -4160 R0
SYMATTR InstName R62
SYMATTR Value 1k
SYMBOL res 2512 -3888 M90
WINDOW 0 0 56 VBottom 2
WINDOW 3 32 56 VTop 2
SYMATTR InstName R63
SYMATTR Value 20k
SYMBOL LED 2704 -4240 M0
SYMATTR InstName D12
SYMBOL res 2064 -4032 R0
SYMATTR InstName R64
SYMATTR Value 10k
SYMBOL res 2976 -624 R0
SYMATTR InstName R65
SYMATTR Value 4
SYMBOL voltage 1104 -864 R270
WINDOW 0 32 56 VTop 2
WINDOW 3 -32 56 VBottom 2
SYMATTR InstName V2
SYMATTR Value 0
SYMBOL voltage -896 -624 R0
SYMATTR InstName V3
SYMATTR Value 0
SYMBOL voltage 912 -656 R0
SYMATTR InstName V4
SYMATTR Value 0
TEXT -224 1136 Left 2 !.tran 0 40m 0 10u
TEXT -224 888 Left 2 !.MODEL MMBT2222A  NPN (IS=25.4f NF=1.00 BF=274 VAF=114 IKF=0.121 ISE=14.3p NE=2.00 BR=4.00 NR=1.00 VAR=24.0 IKR=0.300 RE=0.219 RB=0.877 RC=87.7m XTB=1.5 CJE=27.6p VJE=1.10 MJE=0.500 CJC=14.2p VJC=0.300 MJC=0.300 TF=622p TR=124n EG=1.12)\n.MODEL MMBT2907A  PNP (IS=60.7f NF=1.00 BF=312 VAF=139 IKF=0.219 ISE=26.0p NE=2.00 BR=4.00 NR=1.00 VAR=20.0 IKR=0.540 RE=85.8m RB=0.343 RC=34.3m XTB=1.5 CJE=50.4p VJE=1.10 MJE=0.500 CJC=23.1p VJC=0.300 MJC=0.300 TF=758p TR=123n EG=1.12)\n.model AONS32304 VDMOS(Kp=239 Rs=0.42m Rd=1.2m Rg=3.0 Vto=2.16 VtoTc=-2.8m Bex=-2.07 mtriode=1.1 Ksubthres=0.1 Lambda=0.158 Cgdmax=1420p Cgdmin=288p Cgs=5352p tt=19n A=0.7 Is=2.35E-11 N=1.017 Eg=1.07 Rb=0.1m Trb1=-1 BV=33 IBV=250u M=0.456 Vj=0.56 Cjo=1090.0pF mfg=AOS Vds=30 Ron=1.8m Qg=40n)\n.model MMBFJ201 NJF(BETA=0.000896 IS=3E-12 VTO=-0.794 LAMBDA=0.02 RD=0.001 RS=0.0013)
TEXT -224 1024 Left 2 !.inc AO3401A.sub\n.inc IRLB8721.sub
TEXT -224 1080 Left 2 !.inc 1N4736A.sub
TEXT -216 1192 Left 2 ;.options plotwinsize=0\n.options numdgt=6\n.options reltol=0.001 abstol=1u\n.options solver=alternate
TEXT -224 1104 Left 2 !.include irlml6402.spi
TEXT -216 1168 Left 2 !.inc 1N4730A.sub
TEXT -216 848 Left 2 !.model LED_RED D(Is=2e-9 N=2.2 Rs=10 Bv=5 Ibv=0.1 Cjo=20p M=0.4 Vj=0.65)
TEXT -968 752 Left 2 ;.op

The netlist it stands for:
* 5_bancos.asc
Q12_3 N147 N150 0 0 MMBT2222A
R12_5 N141 N147 33k
R12_4 N135 N141 4.7k
Q12_1 N138 N140 0 0 MMBT2222A
R12_3 N133 N138 1k
R12_2 out_1 N133 10k
R12_6 N150 N149 20k
Vcell12 N132 N137 3.3
Q12_2 N135 N133 out_1 0 MMBT2907A
X§S12 N143 N141 N137 IRLB8721  ; pins D G S
Q21_3 N119 N126 0 0 MMBT2222A
R21_5 N114 N119 33k
R21_4 N103 N114 4.7k
Q21_1 N105 N109 0 0 MMBT2222A
R21_3 N099 N105 1k
R21_2 out_2 N099 10k
R21_6 N126 N125 20k
Vcell21 N101 N112 3.3
Q21_2 N103 N099 out_2 0 MMBT2907A
X§S21 N131 N114 N112 IRLB8721  ; pins D G S
Q22_3 N121 N128 0 0 MMBT2222A
R22_5 N115 N121 33k
R22_4 N104 N115 4.7k
Q22_1 N106 N111 0 0 MMBT2222A
R22_3 N100 N106 1k
R22_2 out_2 N100 10k
R22_6 N128 N127 20k
Vcell22 N102 N113 3.3
Q22_2 N104 N100 out_2 0 MMBT2907A
X§S22 N122 N115 N113 IRLB8721  ; pins D G S
Vcontrol1 VcMAS 0 PULSE(0 5 0 1p 1p 10m 20m)
Vcontrol2 VcMENOS 0 PULSE(0 5 10m 1p 1p 10m 20m)
Voff VcOFF 0 5
Von VcON 0 0
R21_1 N109 VcON 20k
R22_1 N111 VcON 20k
R12_1 N140 VcOFF 20k
Rout12 out_1 N132 1m
Rout21 out_2 N101 1m
Rout22 out_2 N102 1m
Q1_1 N144 N148 0 0 MMBT2222A
R1_9 N148 VcON 20k
R1_7 out_1 N134 47k
Q2_1 N129 N130 0 0 MMBT2222A
R2_9 N130 VcOFF 20k
R2_7 out_2 N116 47k
Vcontrol3 VcMAS_delayed 0 PULSE(0 5 1m 1p 1p 10m 20m)
Vcontrol4 VcMENOS_delayed 0 PULSE(0 5 10.1m 1p 1p 10m 20m)
X§Sgnd12 N137 N141 0 IRLB8721  ; pins D G S
Q31_1 N086 N092 0 0 MMBT2222A
R31_5 N082 N086 33k
R31_4 N071 N082 4.7k
Q2 N073 N076 0 0 MMBT2222A
R31_3 N067 N073 10K
R31_2 N066 N067 100K
R31_6 N092 N091 20k
Vcell31 N069 N080 3.3
Q31_2 N071 N067 N066 0 MMBT2907A
X§S31 N098 N082 N080 IRLB8721  ; pins D G S
Q32_1 N088 N094 0 0 MMBT2222A
R32_5 N083 N088 33k
R32_4 N072 N083 4.7k
Q5 N074 N078 0 0 MMBT2222A
R32_3 N068 N074 1k
R32_2 N066 N068 10k
R32_6 N094 N093 20k
Vcell32 N070 N081 3.3
Q32_2 N072 N068 N066 0 MMBT2907A
X§S32 N089 N083 N081 IRLB8721  ; pins D G S
R31_1 N076 VcOFF 20k
R32_1 N078 VcOFF 20k
Rout31 N066 N069 1m
Rout32 N066 N070 1m
Q3_1 N095 N097 0 0 MMBT2222A
R3_9 N097 VcON 20k
R3_7 N066 N084 47k
R16 N089 out_2 1m
R17 N098 out_2 1m
A1 VcOFF 0 0 0 0 N091 0 0 BUF
A2 VcOFF 0 0 0 0 N093 0 0 BUF
A3 VcON 0 0 0 0 N127 0 0 BUF
A4 VcON 0 0 0 0 N125 0 0 BUF
A6 VcOFF 0 0 0 0 N149 0 0 BUF
X§S4 N089 N084 N066 irlml6402  ; pins D G S
X§S2 N123 N116 out_2 irlml6402  ; pins D G S
X§S1 N143 N134 out_1 irlml6402  ; pins D G S
V1 N143 out_neg 0
Q3 N146 P001 0 0 MMBT2222A
R3 N139 N146 1k
R4 VcOFF P001 20k
D4 VcON N139 D
Q4 N118 P002 0 0 MMBT2222A
R5 N108 N118 1k
R6 VcON P002 20k
D6 VcON N108 D
Q6 N120 P003 0 0 MMBT2222A
R7 N110 N120 1k
R8 VcON P003 20k
D7 VcON N110 D
Q7 N087 P004 0 0 MMBT2222A
R9 N077 N087 1k
R10 VcOFF P004 20k
D8 VcON N077 D
Q8 N085 P005 0 0 MMBT2222A
R11 N075 N085 1k
R12 VcOFF P005 20k
D9 VcON N075 D
Q9 N090 N096 0 0 MMBT2222A
R13 N079 N090 1k
R14 VcON N096 20k
D10 VcON N079 D
Q10 N117 N124 0 0 MMBT2222A
R15 N107 N117 1k
R18 VcOFF N124 20k
D13 VcON N107 D
Q11 N142 N145 0 0 MMBT2222A
R19 N136 N142 1k
R20 VcON N145 20k
D14 VcON N136 D
R1_8 N134 N144 30k
R2_8 N116 N129 10k
R3_8 N084 N095 10k
Q1 N053 N059 0 0 MMBT2222A
R1 N049 N053 33k
R2 N038 N049 4.7k
Q12 N040 N043 0 0 MMBT2222A
R21 N034 N040 10K
R22 N033 N034 100K
R23 N059 N058 20k
Vcell1 N036 N047 3.3
Q13 N038 N034 N033 0 MMBT2907A
X§S3 N065 N049 N047 IRLB8721  ; pins D G S
Q14 N055 N061 0 0 MMBT2222A
R24 N050 N055 33k
R25 N039 N050 4.7k
Q15 N041 N045 0 0 MMBT2222A
R26 N035 N041 1k
R27 N033 N035 10k
R28 N061 N060 20k
Vcell2 N037 N048 3.3
Q16 N039 N035 N033 0 MMBT2907A
X§S5 N056 N050 N048 IRLB8721  ; pins D G S
R29 N043 VcOFF 20k
R30 N045 VcOFF 20k
Rout1 N033 N036 1m
Rout2 N033 N037 1m
Q17 N062 N064 0 0 MMBT2222A
R31 N064 VcON 20k
R32 N033 N051 47k
R33 N056 N066 1m
R34 N065 N066 1m
A5 VcOFF 0 0 0 0 N058 0 0 BUF
A7 VcOFF 0 0 0 0 N060 0 0 BUF
X§S6 N056 N051 N033 irlml6402  ; pins D G S
Q18 N054 P006 0 0 MMBT2222A
R35 N044 N054 1k
R36 VcOFF P006 20k
D1 VcON N044 D
Q19 N052 P007 0 0 MMBT2222A
R37 N042 N052 1k
R38 VcOFF P007 20k
D2 VcON N042 D
Q20 N057 N063 0 0 MMBT2222A
R39 N046 N057 1k
R40 VcON N063 20k
D3 VcON N046 D
R41 N051 N062 10k
Q21 N020 N026 0 0 MMBT2222A
R42 N016 N020 33k
R43 N005 N016 4.7k
Q22 N007 N010 0 0 MMBT2222A
R44 N001 N007 10K
R45 out_pos N001 100K
R46 N026 N025 20k
Vcell3 N003 N014 3.3
Q23 N005 N001 out_pos 0 MMBT2907A
X§S7 N032 N016 N014 IRLB8721  ; pins D G S
Q24 N022 N028 0 0 MMBT2222A
R47 N017 N022 33k
R48 N006 N017 4.7k
Q25 N008 N012 0 0 MMBT2222A
R49 N002 N008 1k
R50 out_pos N002 10k
R51 N028 N027 20k
Vcell4 N004 N015 3.3
Q26 N006 N002 out_pos 0 MMBT2907A
X§S8 N023 N017 N015 IRLB8721  ; pins D G S
R52 N010 VcOFF 20k
R53 N012 VcOFF 20k
Rout3 out_pos N003 1m
Rout4 out_pos N004 1m
Q27 N029 N031 0 0 MMBT2222A
R54 N031 VcON 20k
R55 out_pos N018 47k
R56 N023 N033 1m
R57 N032 N033 1m
A8 VcOFF 0 0 0 0 N025 0 0 BUF
A9 VcOFF 0 0 0 0 N027 0 0 BUF
X§S9 N023 N018 out_pos irlml6402  ; pins D G S
Q28 N021 P008 0 0 MMBT2222A
R58 N011 N021 1k
R59 VcOFF P008 20k
D5 VcON N011 D
Q29 N019 P009 0 0 MMBT2222A
R60 N009 N019 1k
R61 VcOFF P009 20k
D11 VcON N009 D
Q30 N024 N030 0 0 MMBT2222A
R62 N013 N024 1k
R63 VcON N030 20k
D12 VcON N013 D
R64 N018 N029 10k
R65 out_pos out_neg 4
V2 N122 N123 0
V3 N131 out_1 0
V4 N122 out_1 0
.model D D
.lib standard.dio
.model NPN NPN
.model PNP PNP
.lib standard.bjt
.tran 0 40m 0 10u
.MODEL MMBT2222A  NPN (IS=25.4f NF=1.00 BF=274 VAF=114 IKF=0.121 ISE=14.3p NE=2.00 BR=4.00 NR=1.00 VAR=24.0 IKR=0.300 RE=0.219 RB=0.877 RC=87.7m XTB=1.5 CJE=27.6p VJE=1.10 MJE=0.500 CJC=14.2p VJC=0.300 MJC=0.300 TF=622p TR=124n EG=1.12)
.MODEL MMBT2907A  PNP (IS=60.7f NF=1.00 BF=312 VAF=139 IKF=0.219 ISE=26.0p NE=2.00 BR=4.00 NR=1.00 VAR=20.0 IKR=0.540 RE=85.8m RB=0.343 RC=34.3m XTB=1.5 CJE=50.4p VJE=1.10 MJE=0.500 CJC=23.1p VJC=0.300 MJC=0.300 TF=758p TR=123n EG=1.12)
.model AONS32304 VDMOS(Kp=239 Rs=0.42m Rd=1.2m Rg=3.0 Vto=2.16 VtoTc=-2.8m Bex=-2.07 mtriode=1.1 Ksubthres=0.1 Lambda=0.158 Cgdmax=1420p Cgdmin=288p Cgs=5352p tt=19n A=0.7 Is=2.35E-11 N=1.017 Eg=1.07 Rb=0.1m Trb1=-1 BV=33 IBV=250u M=0.456 Vj=0.56 Cjo=1090.0pF mfg=AOS Vds=30 Ron=1.8m Qg=40n)
.model MMBFJ201 NJF(BETA=0.000896 IS=3E-12 VTO=-0.794 LAMBDA=0.02 RD=0.001 RS=0.0013)
.inc AO3401A.sub
.inc IRLB8721.sub
.inc 1N4736A.sub
* .options plotwinsize=0
* .options numdgt=6
* .options reltol=0.001 abstol=1u
* .options solver=alternate
.include irlml6402.spi
.inc 1N4730A.sub
.model LED_RED D(Is=2e-9 N=2.2 Rs=10 Bv=5 Ibv=0.1 Cjo=20p M=0.4 Vj=0.65)
* .op
.backanno
.end